# Altium project TheBetterArduino.PrjPcb
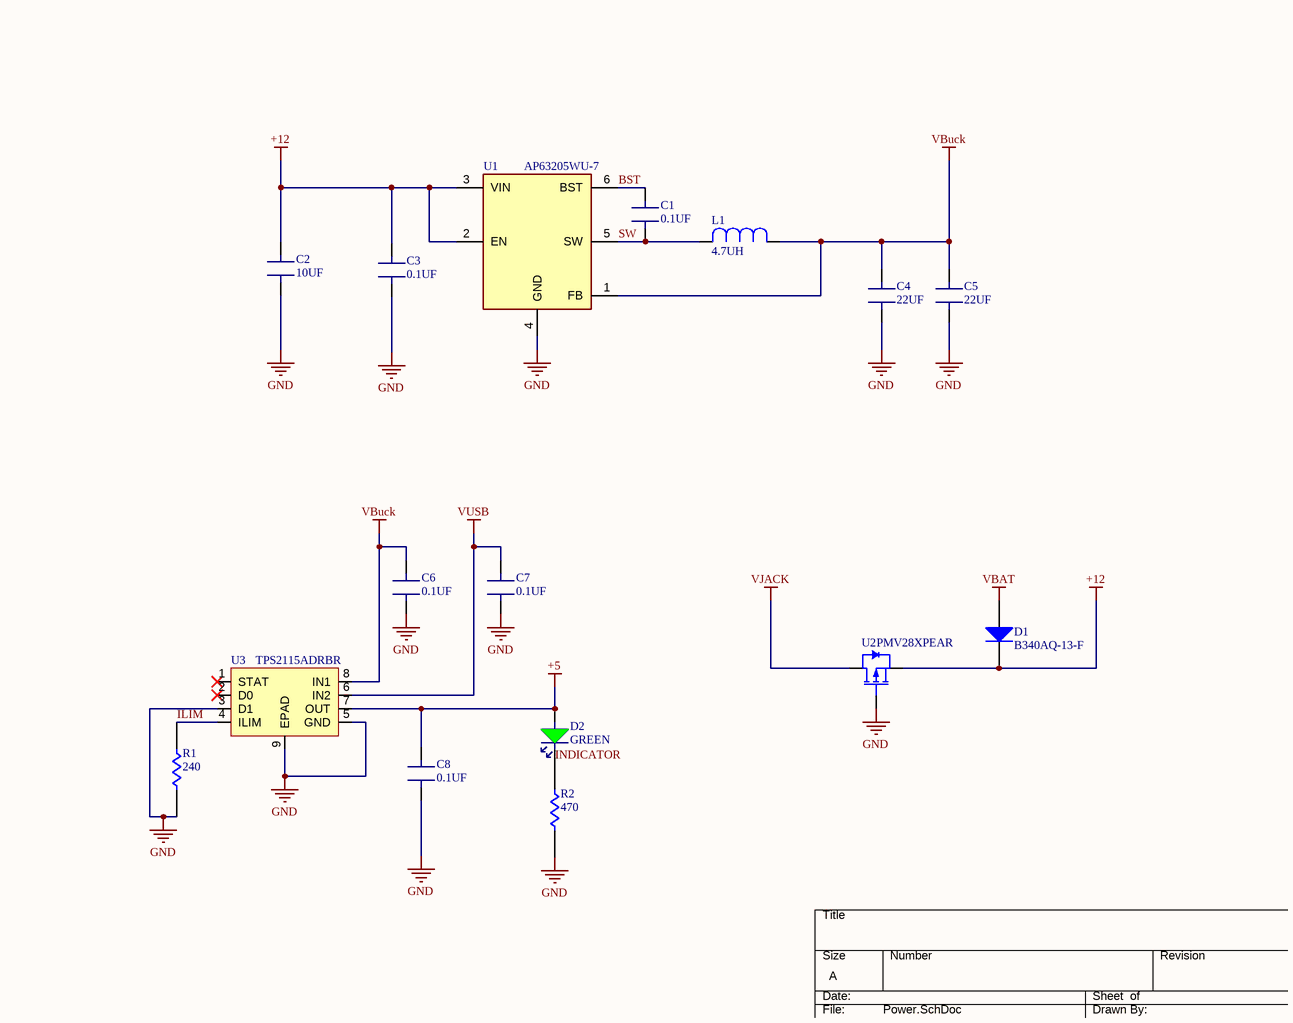
[diagram p0: Power.SchDoc]
3 sheets, 56 parts. Net scope: global (net labels, ports and power ports of the same name join across sheets).
Board file: TheBetterArduinoBoard.PcbDoc
Sheets:
  Power.SchDoc
  Main.SchDoc
  Connectors_USB.SchDoc

## Sheet Power.SchDoc
size A; SheetNumber: 1; SheetTotal: 3

### Parts
C1  0.1UF  [CAP: 0603]
C2  10UF  [CAP: 0805]
C3  0.1UF  [CAPC1608X90N]
C4  22UF  [CAP: 0805]
C5  22UF  [CAP: 0805]
C6  0.1UF  [CAPC1608X90N]
C7  0.1UF  [CAPC1608X90N]
C8  0.1UF  [CAPC1608X90N]
D1  B340AQ-13-F  [DO-214AC]
D2  GREEN  [LED: 0805G]
L1  4.7UH  [IND: VLS5045EX-4R7M-H]
R1  240  [RESC1608X55N]
R2  470  [RESC1608X55N]
U1  AP63205WU-7  [TSOT23-6]
U2  PMV28XPEAR  [SOT23_3]
U3  TPS2115ADRBR  [8-SON (3x3)]

### Nets
+5: C8.2(B) D2.2(A) U3.7(OUT)
+12: C2.2(B) C3.2(B) D1.2(C) U1.2(EN) U1.3(VIN) U2.2(S)
GND: C2.1(A) C3.1(A) C4.1(A) C5.1(A) C6.1(A) C7.1(A) C8.1(A) R1.1 R2.1 U1.4(GND) U2.1(G) U3.3(D1) U3.5(GND) U3.9(EPAD)
VBAT: D1.1(A)
VBuck: C4.2(B) C5.2(B) C6.2(B) L1.2 U1.1(FB) U3.8(IN1)
VJACK: U2.3(D)
VUSB: C7.2(B) U3.6(IN2)
BST: C1.2(B) U1.6(BST)
ILIM: R1.2 U3.4(ILIM)
INDICATOR: D2.1(C) R2.2
SW: C1.1(A) L1.1 U1.5(SW)

Not connected (* = marked no-connect by the designer): U3 1(STAT)* 2(D0)*

### Notes on the sheet
- DWG. NO.
- REV.
- SHT.
- THIS DOCUMENT AND THE DATA DISCLOSED HEREIN OR HEREWITH IS THE PROPERTY OF ALTIUM LIMITED AND MAY BE FREELY DISTRIBUTED IN WHOLE. NO RIGHTS ARE RESERVED OR EXPRESS OR IMPLIED WARANTEE GIVEN.
- REVISION
- DESCRIPTION
- DATE
- APPROVED
- ENG:
- APPROVALS
- PROJECT
- DSN:
- CHK:
- REFERENCE DOCUMENTS
- PROJECT REVISION:
- TITLE
- DOCUMENT REVISION:
- DESIGN ITEM:
- BOM:
- FAB DWG:
- PCB DWG:
- ASSY DWG:
- SCALE:
- SIZE
- B
- CAGE CODE
- FILE NAME
- DWG NO.
- SHEET
- OF
- REV

### Library data of the parts
C1 = CL10B104KB8NNNL: CAP CER 0.1UF 50V X7R 0603; Supplier 1: Mouser; Supplier Part Number 1: 187-CL10B104KB8NNNL
C2 = GRM21BR61H106KE43L: CAP CER 10UF 50V X5R 0805; Supplier 1: Mouser; Supplier Part Number 1: 81-GRM21BR61H106KE3L
C3 C6-C8 = CC0603KRX7R9BB104: CAP CER 0.1UF 50V 10% X7R 0603; Supplier 1: Digi-Key; Supplier Part Number 1: 311-1344-1-ND
C4 C5 = CL21A226MAYNNNE: CAP CER 22UF 25V X5R 0805; Supplier 1: Mouser; Supplier Part Number 1: 187-CL21A226MAYNNNE
D1 = B340AQ-13-F: DIODE SCHOTTKY 40V 3A SMA TR 5K; Supplier 1: Mouser; Supplier Part Number 1: 621-B340AQ-13-F
D2 = 732-4983-6-ND: LED GREEN CLEAR 0805 SMD; Supplier 1: Digi-Key; Supplier Part Number 1: 732-4983-1-ND
L1 = VLS5045EX-4R7M-H: FIXED IND 4.7UH 3.2A 46.8MOHM SM; Supplier 1: Mouser; Supplier Part Number 1: 810-VLS5045EX-4R7M-H
R1 = RMCF0603JT240RDKR-ND: RES 240 OHM 5% 1/10W 0603; Supplier 1: Digi-Key; Supplier Part Number 1: RMCF0603JT240RCT-ND
R2 = 541-4055-6-ND: RES 470 OHM 5% 1/10W 0603; Supplier 1: Digi-Key; Supplier Part Number 1: 541-4055-1-ND
U1 = AP63205WU-7: IC REG BUCK 5V 2A TSOT26; Supplier 1: Mouser; Supplier Part Number 1: 621-AP63205WU-7
U2 = PMV28XPEAR: P-Channel 20 V 5A (Ta) 610mW (Ta), 8.3W (Tc) Surface Mount TO-236AB; Supplier 1: Mouser; Supplier Part Number 1: 771-PMV28XPEAR
U3 = TPS2115ADRBR: OR Controller Source Selector Switch N-Channel 2:1 8-SON (3x3); Supplier 1: Mouser; Supplier Part Number 1: 595-TPS2115ADRBR

## Sheet Main.SchDoc
size A; SheetNumber: 2; SheetTotal: 3
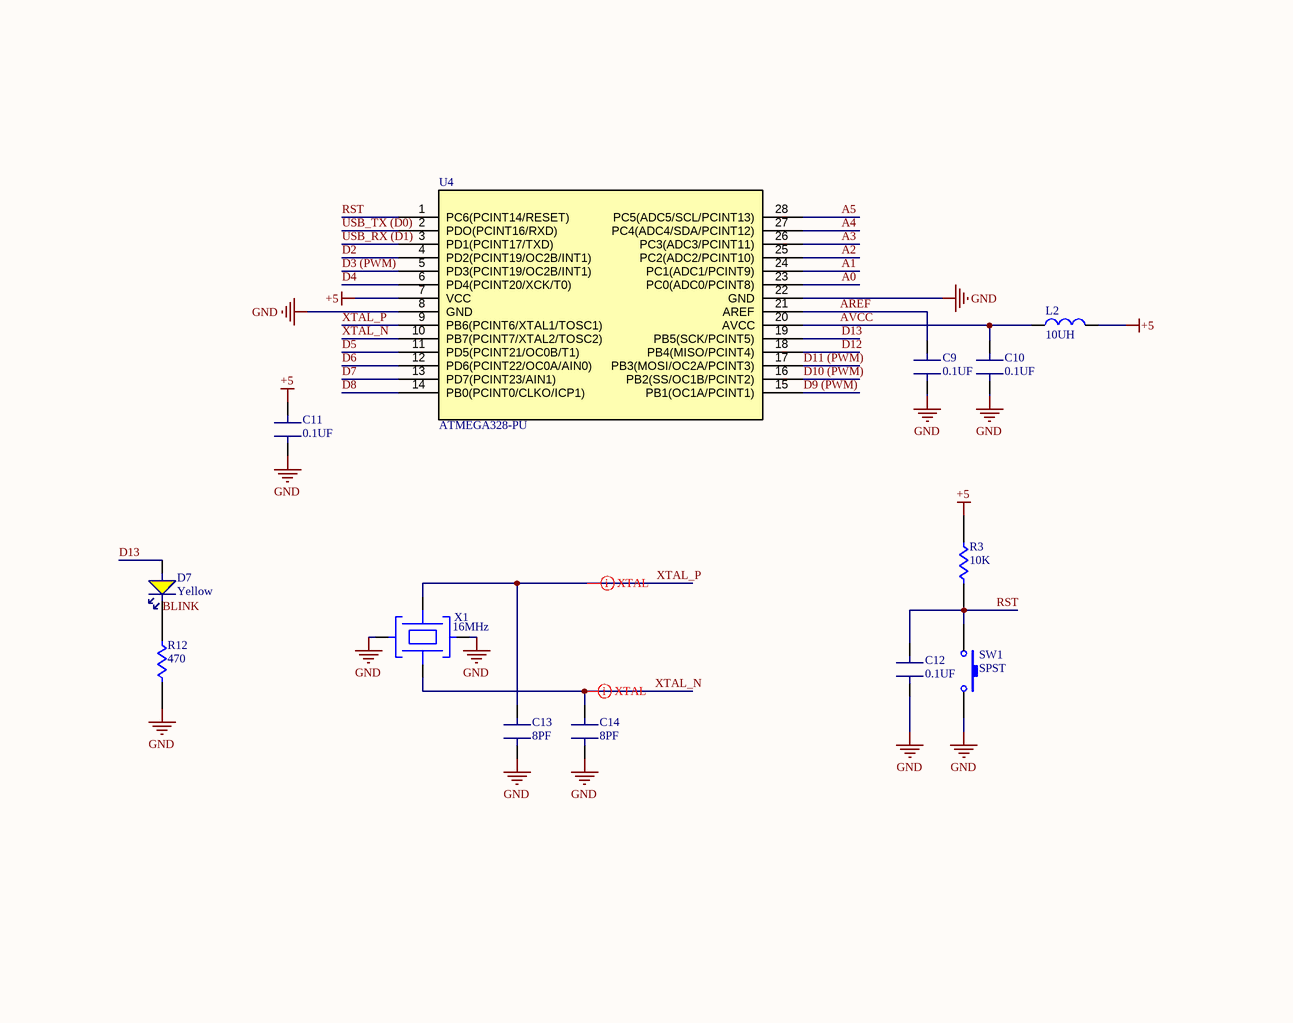
[diagram p1: Main.SchDoc]

### Parts
C9  0.1UF  [CAPC1608X90N]
C10  0.1UF  [CAPC1608X90N]
C11  0.1UF  [CAPC1608X90N]
C12  0.1UF  [CAP: 0603]
C13  8PF  [CAP: 0603]
C14  8PF  [CAP: 0603]
D7  Yellow  [LED: 0805Y]
L2  10UH  [IND: 1210]
R3  10K  [RESC1608X55N]
R12  470  [RESC1608X55N]
SW1  SPST  [MJTP1106STRB]
U4  ATMEGA328-PU  [dip_28]
X1  16MHz  [4-SMD, No Lead]

### Nets
+5: C11.1(A) L2.2(A) R3.2 U4.7(VCC)
GND: C9.2(B) C10.2(B) C11.2(B) C12.1(A) C13.1(A) C14.1(A) R12.1 SW1.1 U4.8(GND) U4.22(GND) X1.2 X1.4
A0: U4.23(PC0(ADC0/PCINT8))
A1: U4.24(PC1(ADC1/PCINT9))
A2: U4.25(PC2(ADC2/PCINT10))
A3: U4.26(PC3(ADC3/PCINT11))
A4: U4.27(PC4(ADC4/SDA/PCINT12))
A5: U4.28(PC5(ADC5/SCL/PCINT13))
AREF: C9.1(A) U4.21(AREF)
AVCC: C10.1(A) L2.1(A) U4.20(AVCC)
BLINK: D7.1(C) R12.2
D2: U4.4(PD2(PCINT19/OC2B/INT1))
D3 (PWM): U4.5(PD3(PCINT19/OC2B/INT1))
D4: U4.6(PD4(PCINT20/XCK/T0))
D5: U4.11(PD5(PCINT21/OC0B/T1))
D6: U4.12(PD6(PCINT22/OC0A/AIN0))
D7: U4.13(PD7(PCINT23/AIN1))
D8: U4.14(PB0(PCINT0/CLKO/ICP1))
D9 (PWM): U4.15(PB1(OC1A/PCINT1))
D10 (PWM): U4.16(PB2(SS/OC1B/PCINT2))
D11 (PWM): U4.17(PB3(MOSI/OC2A/PCINT3))
D12: U4.18(PB4(MISO/PCINT4))
D13: D7.2(A) U4.19(PB5(SCK/PCINT5))
RST: C12.2(B) R3.1 SW1.2 U4.1(PC6(PCINT14/RESET))
USB_RX (D1): U4.3(PD1(PCINT17/TXD))
USB_TX (D0): U4.2(PDO(PCINT16/RXD))
XTAL_N: C14.2(B) U4.10(PB7(PCINT7/XTAL2/TOSC2)) X1.3
XTAL_P: C13.2(B) U4.9(PB6(PCINT6/XTAL1/TOSC1)) X1.1

### Layout directives
differential pair: XTAL_N, XTAL_P

### Notes on the sheet
- DWG. NO.
- REV.
- SHT.
- THIS DOCUMENT AND THE DATA DISCLOSED HEREIN OR HEREWITH IS THE PROPERTY OF ALTIUM LIMITED AND MAY BE FREELY DISTRIBUTED IN WHOLE. NO RIGHTS ARE RESERVED OR EXPRESS OR IMPLIED WARANTEE GIVEN.
- REVISION
- DESCRIPTION
- DATE
- APPROVED
- ENG:
- APPROVALS
- PROJECT
- DSN:
- CHK:
- REFERENCE DOCUMENTS
- PROJECT REVISION:
- TITLE
- DOCUMENT REVISION:
- DESIGN ITEM:
- BOM:
- FAB DWG:
- PCB DWG:
- ASSY DWG:
- SCALE:
- SIZE
- B
- CAGE CODE
- FILE NAME
- DWG NO.
- SHEET
- OF
- REV

### Library data of the parts
C9-C12 = CC0603KRX7R9BB104: CAP CER 0.1UF 50V 10% X7R 0603; Supplier 1: Digi-Key; Supplier Part Number 1: 311-1344-1-ND
C13 C14 = CC0603DRNPO9BN8R0: CAP CER 8PF 50V C0G/NPO 0603; Supplier 1: Mouser; Supplier Part Number 1: 603-CC603DRNPO9BN8R0
D7 = 150080YS75000: LED YELLOW CLEAR 0805 SMD; Supplier 1: Mouser; Supplier Part Number 1: 710-150080YS75000
L2 = NLFV32T-100K-EF: FIXED IND 10UH 250MA 240MOHM SMD; Supplier 1: Mouser; Supplier Part Number 1: 810-NLFV32T-100K-EF
R3 = RC0603FR-0710KL: RES SMD 10K OHM 1% 1/10W 0603; Supplier 1: Mouser; Supplier Part Number 1: 603-RC0603FR-0710KL
R12 = 541-4055-6-ND: RES 470 OHM 5% 1/10W 0603; Supplier 1: Digi-Key; Supplier Part Number 1: 541-4055-1-ND
SW1 = MJTP1106STR: SWITCH TACTILE SPST-NO 0.05A 12V; Supplier 1: Digi-Key; Supplier Part Number 1: 679-2395-1-ND
U4 = ATMEGA328-PU: AVR AVR® ATmega Microcontroller IC 8-Bit 20MHz 32KB (16K x 16) FLASH 28-PDIP; Supplier 1: Mouser; Supplier Part Number 1: 556-ATMEGA328-PU
X1 = ECS-160-10-36-CKM-TR3: CRYSTAL 16.0000MHZ 10PF SMD; Supplier 1: Mouser; Supplier Part Number 1: 520-160-10-36CKM-TR3

## Sheet Connectors_USB.SchDoc
size A; SheetNumber: 3; SheetTotal: 3
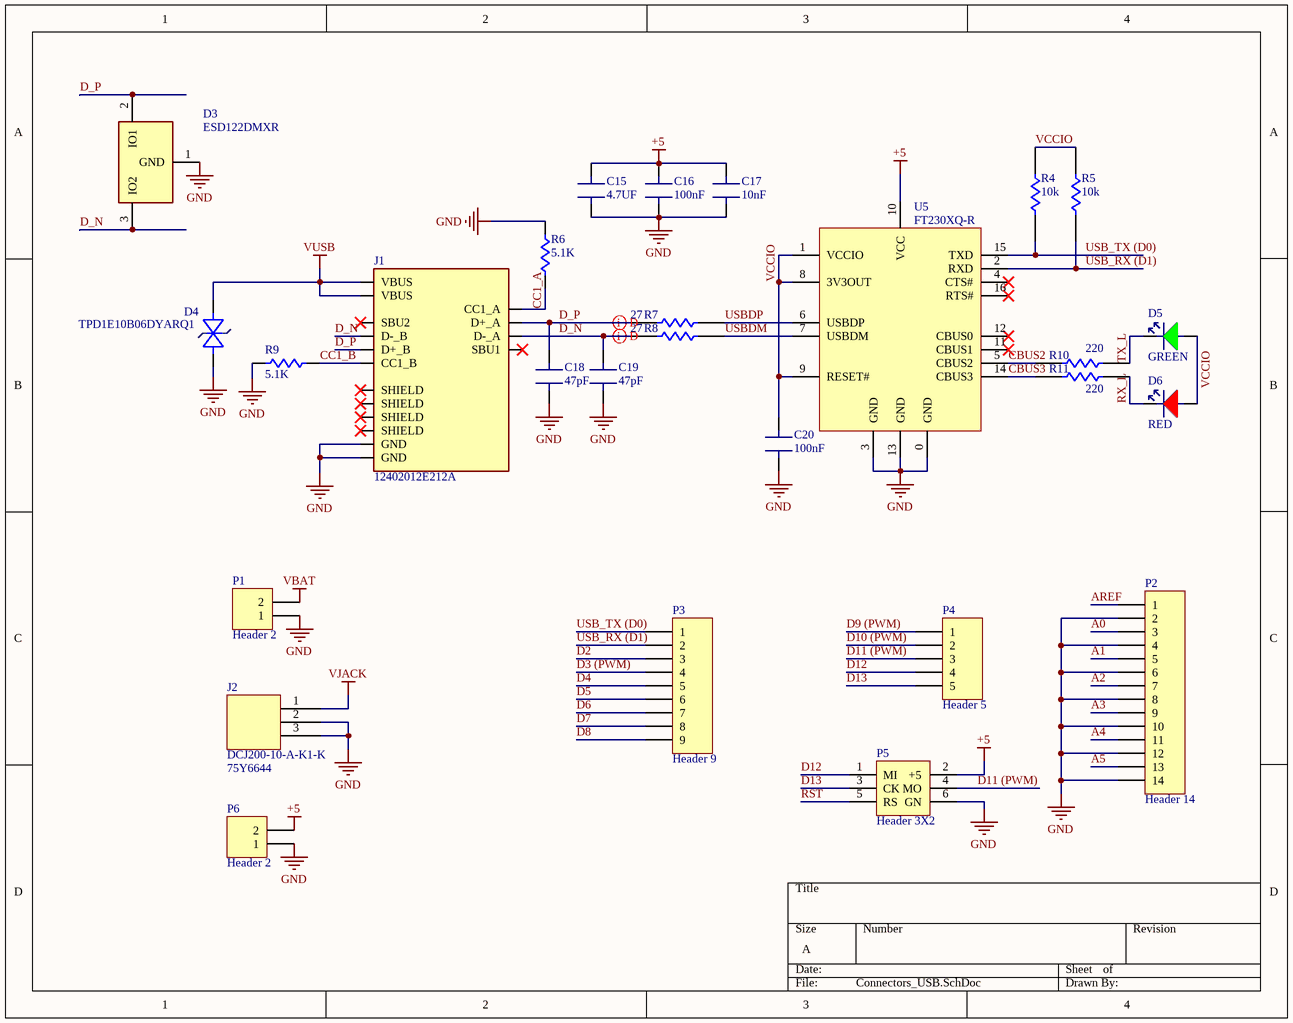
[diagram p2: Connectors_USB.SchDoc]

### Parts
C15  4.7UF  [CAPC1608X90N]
C16  100nF  [CAPC1608X90N]
C17  10nF  [CAPC1608X90N]
C18  47pF  [CAPC1608X90N]
C19  47pF  [CAPC1608X90N]
C20  100nF  [CAPC1608X90N]
D3  ESD122DMXR  [3-X2SON (1x0.6)]
D4  TPD1E10B06DYARQ1  [SOD-523]
D5  GREEN  [LED: 0805G]
D6  RED  [LED: 0805R]
J1  12402012E212A  [AMPHENOL_12402012E212A]
J2  DCJ200-10-A-K1-K  Supplier Part Number 1: 75Y6644  [DC JACK]
P1  Header 2  [HDR1X2]
P2  Header 14  [HDR1X14]
P3  Header 9  [HDR1X9]
P4  Header 5  [HDR1X5]
P5  Header 3X2  [HDR2X3]
P6  Header 2  [HDR1X2]
R4  10k  [RESC1608X55N]
R5  10k  [RESC1608X55N]
R6  5.1K  [RESC1608X55N]
R7  27  [RESC1608X55N]
R8  27  [RESC1608X55N]
R9  5.1K  [RESC1608X55N]
R10  220  [RESC1608X55N]
R11  220  [RESC1608X55N]
U5  FT230XQ-R  [16-QFN (4x4)]

### Nets
+5: C15.2(B) C16.2(B) C17.2(B) P5.2(+5) P6.2 U5.10(VCC)
GND: C15.1(A) C16.1(A) C17.1(A) C18.1(A) C19.1(A) C20.1(A) D3.1(GND) D4.2 J1.A1_B12(GND) J1.B1_A12(GND) J2.2 J2.3 P1.1 P2.2 P2.4 P2.6 P2.8 P2.10 P2.12 P2.14 P5.6(GN) P6.1 R6.2 R9.2 U5.0(GND) U5.3(GND) U5.13(GND)
VBAT: P1.2
VJACK: J2.1
VUSB: D4.1 J1.A4_B9(VBUS) J1.B4_A9(VBUS)
A0: P2.3
A1: P2.5
A2: P2.7
A3: P2.9
A4: P2.11
A5: P2.13
AREF: P2.1
CBUS2: R10.1 U5.5(CBUS2)
CBUS3: R11.1 U5.14(CBUS3)
CC1_A: J1.A5(CC1_A) R6.1
CC1_B: J1.B5(CC1_B) R9.1
D2: P3.3
D3 (PWM): P3.4
D4: P3.5
D5: P3.6
D6: P3.7
D7: P3.8
D8: P3.9
D9 (PWM): P4.1
D10 (PWM): P4.2
D11 (PWM): P4.3 P5.4(MO)
D12: P4.4 P5.1(MI)
D13: P4.5 P5.3(CK)
D_N: C19.2(B) D3.3(IO2) J1.A7(D-_A) J1.B7(D-_B) R8.1
D_P: C18.2(B) D3.2(IO1) J1.A6(D+_A) J1.B6(D+_B) R7.1
RST: P5.5(RS)
RX_L: D6.1(C) R11.2
TX_L: D5.1(C) R10.2
USB_RX (D1): P3.2 R5.1 U5.2(RXD)
USB_TX (D0): P3.1 R4.1 U5.15(TXD)
USBDM: R8.2 U5.7(USBDM)
USBDP: R7.2 U5.6(USBDP)
VCCIO: C20.2(B) D5.2(A) D6.2(A) R4.2 R5.2 U5.1(VCCIO) U5.8(3V3OUT) U5.9(RESET#)

Not connected (* = marked no-connect by the designer): J1 A8(SBU1)* B8(SBU2)* SH1(SHIELD)* SH2(SHIELD)* SH3(SHIELD)* SH4(SHIELD)*; U5 4(CTS#)* 11(CBUS1)* 12(CBUS0)* 16(RTS#)*

### Layout directives
differential pair: D_N, D_P

### Library data of the parts
C15 = 1276-1903-6-ND: CAP CER 4.7UF 25V X5R 0603; Supplier 1: Digi-Key; Supplier Part Number 1: 1276-1903-1-ND
C16 C20 = C14663: CAP CER 0.1UF 50V 10% X7R 0603
C17 = 1292-1386-6-ND: CAP CER 10000PF 50V X7R 0603; Supplier 1: Digi-Key; Supplier Part Number 1: 1292-1386-1-ND
C18 C19 = 311-3899-6-ND: CAP CER 47PF 50V C0G/NPO 0603; Supplier 1: Digi-Key; Supplier Part Number 1: 311-3899-1-ND
D3 = ESD122DMXR: TVS DIODE 3.6VWM 8.4VC 3X2SON; Supplier 1: Mouser; Supplier Part Number 1: 595-ESD122DMXR
D4 = TPD1E10B06DYARQ1: 14V (Typ) Clamp 6A (8/20µs) Ipp Tvs Diode Surface Mount SOT-5X3; Supplier 1: Mouser; Supplier Part Number 1: 595-TPD1E10B06DYARQ1
D5 = 732-4983-6-ND: LED GREEN CLEAR 0805 SMD; Supplier 1: Digi-Key; Supplier Part Number 1: 732-4983-1-ND
D6 = 732-4985-6-ND: LED RED CLEAR 0805 SMD; Supplier 1: Digi-Key; Supplier Part Number 1: 732-4985-1-ND
J1 = 12402012E212A: CONN RCP USB2.0 TYP C 24P SMD RA; Supplier 1: Mouser; Supplier Part Number 1: 523-12402012E212A
J2 = 2073-DCJ200-10-A-K1-K-ND: Power Barrel Connector Jack 2.05mm ID (0.081"), 5.50mm OD (0.217") Through Hole, Right Angle; Supplier 1: Newark
P1 P6 = Header 2: Header, 2-Pin; LatestRevisionDate: 17-Jul-2002; LatestRevisionNote: Re-released for DXP Platform.; Publisher: Altium Limited
P2 = Header 14: Header, 14-Pin; LatestRevisionDate: 17-Jul-2002; LatestRevisionNote: Re-released for DXP Platform.; Publisher: Altium Limited
P3 = Header 9: Header, 9-Pin; LatestRevisionDate: 17-Jul-2002; LatestRevisionNote: Re-released for DXP Platform.; Publisher: Altium Limited
P4 = Header 5: Header, 5-Pin; LatestRevisionDate: 17-Jul-2002; LatestRevisionNote: Re-released for DXP Platform.; Publisher: Altium Limited
P5 = Header 3X2: Header, 3-Pin, Dual row; LatestRevisionDate: 17-Jul-2002; LatestRevisionNote: Re-released for DXP Platform.; Publisher: Altium Limited
R4 R5 = RC0603FR-0710KL: RES SMD 10K OHM 1% 1/10W 0603; Supplier 1: Digi-Key; Supplier Part Number 1: 311-10.0KHRCT-ND
R6 R9 = 541-CRCW06035K10FKEBCDKR-ND: RES 5.1K OHM 1% 1/10W 0603; Supplier 1: Digi-Key; Supplier Part Number 1: 541-CRCW06035K10FKEBCCT-ND
R7 R8 = CR0603-FX-27R0ELFDKR-ND: RES SMD 27 OHM 1% 1/10W 0603; Supplier 1: Digi-Key; Supplier Part Number 1: CR0603-FX-27R0ELFCT-ND
R10 R11 = 311-220HRDKR-ND: RES SMD 220 OHM 1% 1/10W 0603; Supplier 1: Digi-Key; Supplier Part Number 1: 311-220HRCT-ND
U5 = FT230XQ-R: USB Bridge, USB to UART USB 2.0 UART Interface 16-QFN (4x4); Supplier 1: Mouser; Supplier Part Number 1: 895-FT230XQ-R

## Nets that join several sheets
+5: Power (C8.2 D2.2 U3.7), Main (C11.1 L2.2 R3.2 U4.7), Connectors_USB (6 pins)
GND: Power (14 pins), Main (12 pins), Connectors_USB (27 pins)
VBAT: Power (D1.1), Connectors_USB (P1.2)
VJACK: Power (U2.3), Connectors_USB (J2.1)
VUSB: Power (C7.2 U3.6), Connectors_USB (D4.1 J1.A4_B9 J1.B4_A9)
A0: Main (U4.23), Connectors_USB (P2.3)
A1: Main (U4.24), Connectors_USB (P2.5)
A2: Main (U4.25), Connectors_USB (P2.7)
A3: Main (U4.26), Connectors_USB (P2.9)
A4: Main (U4.27), Connectors_USB (P2.11)
A5: Main (U4.28), Connectors_USB (P2.13)
AREF: Main (C9.1 U4.21), Connectors_USB (P2.1)
D2: Main (U4.4), Connectors_USB (P3.3)
D3 (PWM): Main (U4.5), Connectors_USB (P3.4)
D4: Main (U4.6), Connectors_USB (P3.5)
D5: Main (U4.11), Connectors_USB (P3.6)
D6: Main (U4.12), Connectors_USB (P3.7)
D7: Main (U4.13), Connectors_USB (P3.8)
D8: Main (U4.14), Connectors_USB (P3.9)
D9 (PWM): Main (U4.15), Connectors_USB (P4.1)
D10 (PWM): Main (U4.16), Connectors_USB (P4.2)
D11 (PWM): Main (U4.17), Connectors_USB (P4.3 P5.4)
D12: Main (U4.18), Connectors_USB (P4.4 P5.1)
D13: Main (D7.2 U4.19), Connectors_USB (P4.5 P5.3)
RST: Main (C12.2 R3.1 SW1.2 U4.1), Connectors_USB (P5.5)
USB_RX (D1): Main (U4.3), Connectors_USB (P3.2 R5.1 U5.2)
USB_TX (D0): Main (U4.2), Connectors_USB (P3.1 R4.1 U5.15)